# Altium schematic sheet RCA.SchDoc
size A
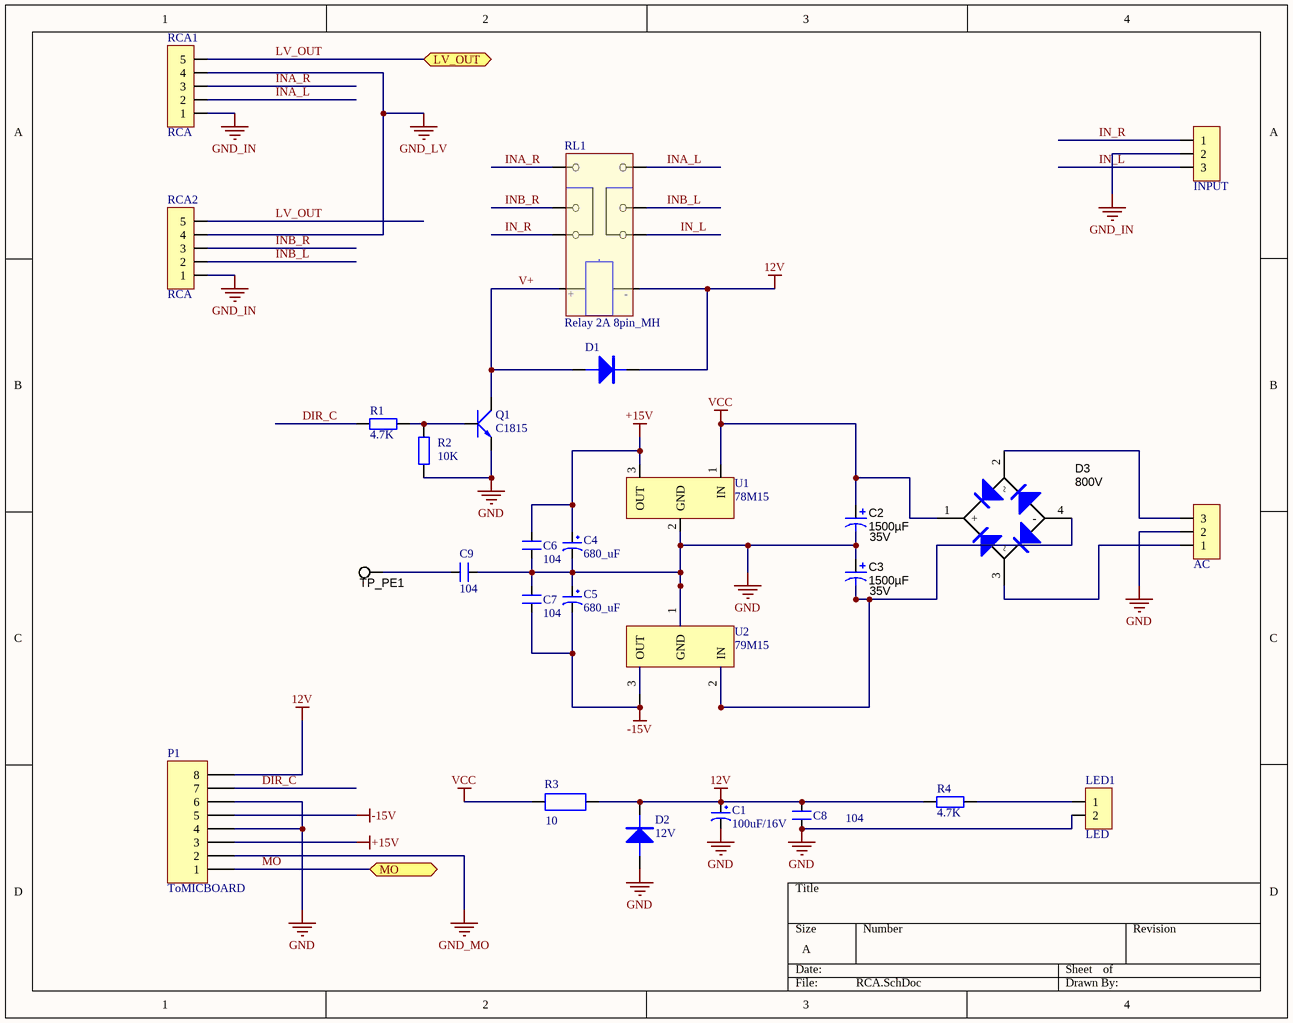
[diagram p0: RCA.SchDoc]

## Parts
AC  Header 3_MH  [HEADER 3]  (value not drawn)
C1  100uF/16V  [NHG_1000x2200]
C2  ValueDisplayed: 1500µF  Value2: 35V  [FC_1250x2500]  (hidden comment: ELZA350ELL152MK25S)
C3  ValueDisplayed: 1500µF  Value2: 35V  [FC_1250x2500]  (hidden comment: ELZA350ELL152MK25S)
C4  680_uF  [NHG_1000x2200]
C5  680_uF  [NHG_1000x2200]
C6  104  [TU_GOM(104-->105pF)]
C7  104  [TU_GOM(104-->105pF)]
C8  104  [TU_GOM(104-->105pF)]
C9  104  [TU_GOM(104-->105pF)]
D1  Diode 1N4001 DO41 1A 50V (DIP)_MH  [SS14]  (value not drawn)
D2  12V  [Diode Zener 1N5359B 5W 24V]
D3  value 800V  [GBU]  (hidden comment: GBU4K-E3/45)
INPUT  Header 3_MH  [HEADER 3]  (value not drawn)
LED1  LED  [HEADER 2]
P1  ToMICBOARD  [HEADER2M_8P]
Q1  C1815  [TO92]
R1  4.7K  [TRO_VACH_ 1/4W]
R2  10K  [TRO_VACH_ 1/4W]
R3  value 10  [TRO_VACH_2W]  (hidden comment: TRO_CS_2W_MH)
R4  4.7K  [TRO_VACH_ 1/4W]
RCA1  RCA  [RCA3P]
RCA2  RCA  [RCA3P]
RL1  Relay 2A 8pin_MH  [RY-12W-K 12V]
TP_PE1  5012  [Keystone5012]  (value not drawn)
U1  78M15  [TO-220AB]
U2  79M15  [TO-220AB]

## Ports
LV_OUT, MO

## Nets
12V: C1.1 C8.2 D1.2 D2.2 P1.8 R3.2 R4.1 RL1.2
+15V: C4.1 C6.2 P1.3 U1.3(OUT)
-15V: C5.2 C7.1 P1.5 U2.3(OUT)
GND: AC.2 C1.2 C2.2(-) C3.1(+) C4.2 C5.1 C6.1 C7.2 C8.1 C9.1 D2.1 LED1.2 P1.4 P1.6 Q1.1(E) R2.1 U1.2(GND) U2.1(GND)
GND_IN: INPUT.2 RCA1.1 RCA2.1
GND_LV: RCA1.4 RCA2.4
GND_MO: P1.2
VCC: C2.1(+) D3.1(+) R3.1 U1.1(IN)
DIR_C: P1.7 R1.1
IN_L: INPUT.3 RL1.4
IN_R: INPUT.1 RL1.3
INA_L: RCA1.2 RL1.8
INA_R: RCA1.3 RL1.7
INB_L: RCA2.2 RL1.6
INB_R: RCA2.3 RL1.5
LV_OUT: RCA1.5 RCA2.5 ; port LV_OUT
MO: P1.1 ; port MO
V+: D1.1 Q1.2(C) RL1.1
NetAC_1: AC.1 D3.3
NetAC_3: AC.3 D3.2
NetC3_2: C3.2(-) D3.4(-) U2.2(IN)
NetC9_2: C9.2 TP_PE1.1
NetLED1_1: LED1.1 R4.2
NetQ1_3: Q1.3(B) R1.2 R2.2

## Notes on the sheet
- (in symbol Relay 2A 8pin_MH) +; -

## Library data of the parts
AC INPUT = Header 3_MH: Header 3P XH2.54 thẳng
C1 = TU_HOA_100uF_16V_MH: TU_HOA_100uF_16V; Value: 100uF/35V/50V; Description 1: 1000uF/6,3V - 470uF/16V - 330uF - 25V; Description 2: 220uF/35V - 100uF/50V - 63V - 4,7uF/200V; Description 3: 22uF => 33uF100V - 3,3uF => 4,7uF/250V; Description 4: 2,2uF =>3,3uF/350 - 2,2uF/400V - 1uF/450V
C2 C3 = EEU-FC1H561: CAP ALUM 1500UF 20% 35V RADIAL; Manufacturer: Panasonic; Polarized: Y; CompType: Capacitor; U/M: EA; Cap_F: 0.00056; Tolerance_%: 20; Value1: 0.05 ohm; VDC_V: 35; ESR_ohm: 0.05; IRMS_A: 1.832; TaMin_C: -55; TaMax_C: 105; Cap_Case: 12.5x25mm; SymbolVersion: 2008-07-09; Value: 1500uF; PartNumber: ELZA350ELL152MK25S; PackageReference: D12.5xL25mm; RoHS: Y; MountType: TH; Technology: AL; Series: FC; Publisher: Texas Instruments; LatestRevisionDate: 2015-07-24; ComponentLink1Description: Datasheet link; ComponentLink1URL: http://industrial.panasonic.com/lecs/www-data/pdf/ABA0000/ABA0000CE22.pdf; Supplier 1: Digi-Key; Supplier 2: Mouser; Supplier Part Number 2: 565-3374-ND
C4 C5 = TU_HOA_680_uF_25V_MH: TU_HOA_680_uF_25V; Value: 100uF/35V/50V; Description 1: 1000uF/6,3V - 470uF/16V - 330uF - 25V; Description 2: 220uF/35V - 100uF/50V - 63V - 4,7uF/200V; Description 3: 22uF => 33uF100V - 3,3uF => 4,7uF/250V; Description 4: 2,2uF =>3,3uF/350 - 2,2uF/400V - 1uF/450V
C6-C9 = TU_MICA_ 104 100V(2A104J)_MH: Value: 0.1uF
D1 = Diode 1N4001 DO41 1A 50V (DIP)_MH: Diode 1N4001 DO41 1A 50V (DIP)
D2 = Diode 1N4148 DO35 450mA 100V ( 1N4148 DIP)_MH: Diode 1N4148 DO35 450mA 100V ( 1N4148 DIP)
D3 = GBU4K-E3/45: Diode, Switching-Bridge, 800V, 4A, TH; Manufacturer: Vishay-Semiconductor; U/M: EA; Vf_V: 1; Value2: 1V; Io_A: 4; Vr_V: 800; TJmax_C: 150; RJC_CperW: 4.2; RoHS: Y; Supplier 1: Digi-Key; PackageReference: GBU; Type: Switching-Bridge; Supplier Part Number 1: GBU4K-E3/45GI-ND; MountType: TH; PartNumber: GBU4K-E3/45; CompType: Diode; SymbolVersion: 2009-10-05; Value1: 4A; Published: 2008-06-26; Publisher: Texas Instruments; LatestRevisionDate: 2013-12-05; ComponentLink1Description: Datasheet link; ComponentLink1URL: http://www.vishay.com/docs/88614/gbu4a.pdf; Supplier 2: Mouser; Supplier Part Number 2: 625-GBU4K-E3; Supplier 3: Farnell; Supplier Part Number 3: 9549463
LED1 = Header 2_MH: Header 2P XH2.54 thẳng
P1 = Header 8: Header, 8-Pin; LatestRevisionDate: 17-Jul-2002; LatestRevisionNote: Re-released for DXP Platform.; Publisher: Altium Limited
Q1 = C1815 TO92 TRANS NPN 0.15A 50V (DIP)_MH
R1 R2 R4 = TRO_VACH_1/2W_MH: Resistor; Value: 1K; Published: 8-Jun-2000; LatestRevisionDate: 17-Jul-2002; LatestRevisionNote: Re-released for DXP Platform.; Publisher: Altium Limited
RCA1 RCA2 = Header 5_MH: Header 5P XH2.54 thẳng
RL1 = Relay 2A 8pin_MH: rele 2A
TP_PE1 = 5012: Test Point, Multipurpose, White, TH; Manufacturer: Keystone; CompType: Test Point Loop; ContactFinish: Silver; SymbolVersion: 2008-04-04; PartNumber: 5012; PackageReference: White Multipurpose Testpoint; RoHS: Y; MountType: TH; ComponentLink1Description: Datasheet URL; ComponentLink1URL: http://www.keyelco.com/userAssets/file/M60-2p60.pdf; Color: White; Publisher: Texas Instruments; LatestRevisionDate: 2017-01-19; Supplier 1: Digi-Key; Supplier Part Number 1: 36-5012-ND; Supplier 2: Mouser; Supplier Part Number 2: 534-5012
U1 = 78M12: 78M12 TO252_MH
U2 = 7915: 78M12 TO252_MH